# Altium project DSO.PrjPCB
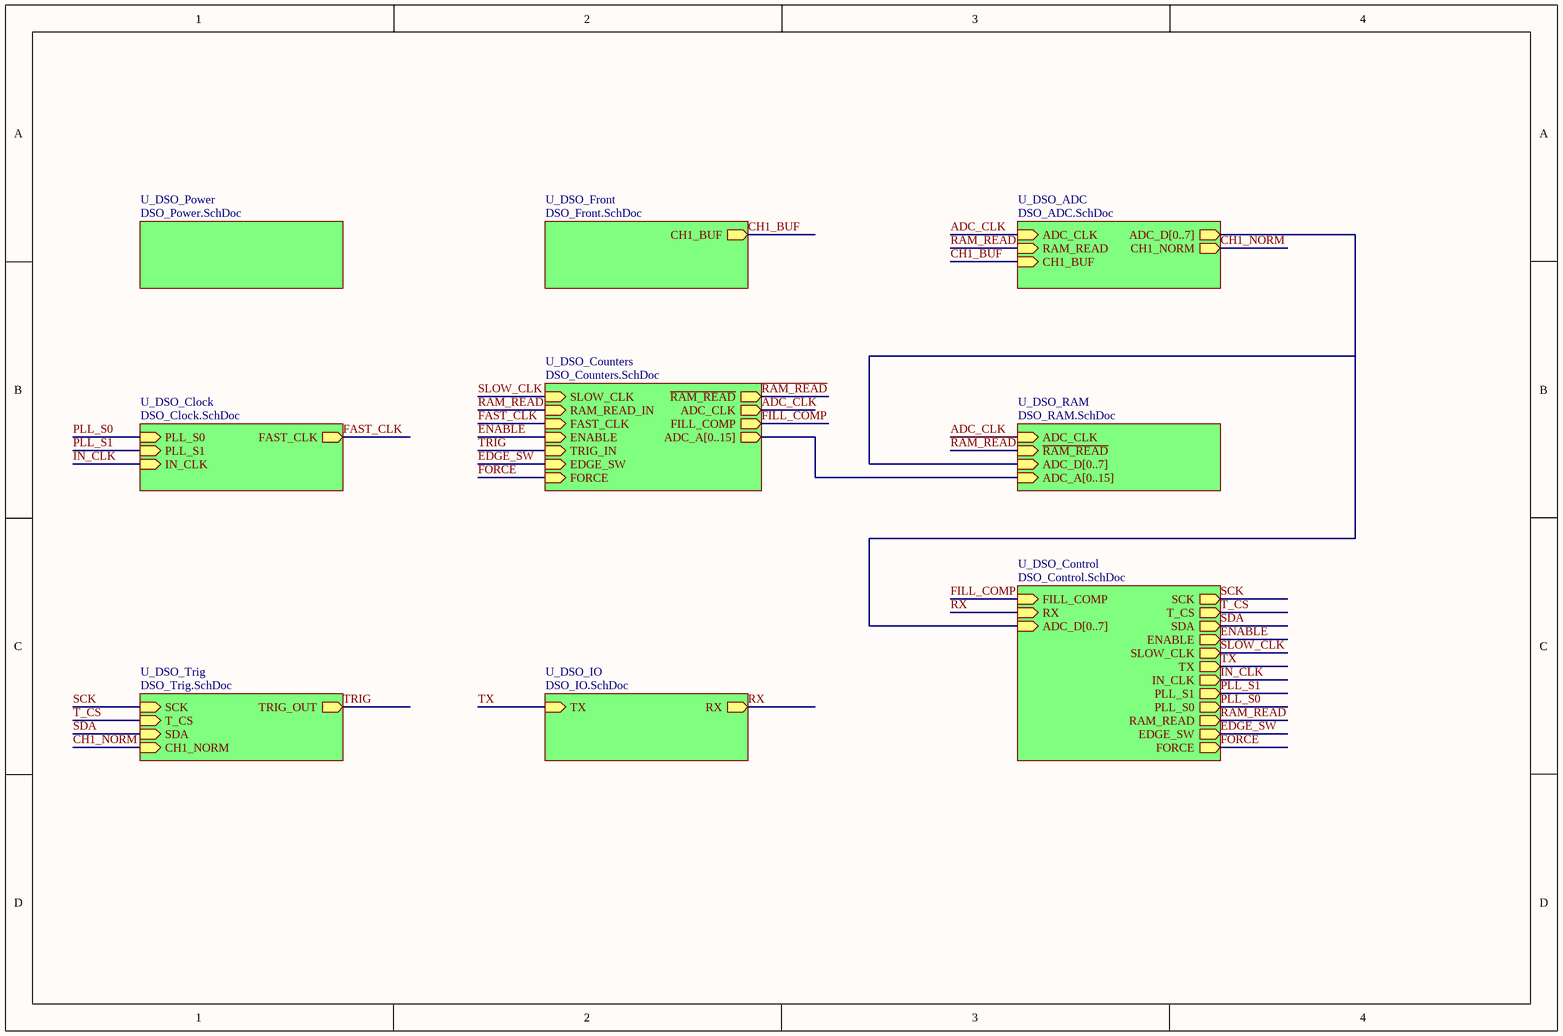
[diagram p0: DSO_Top.SchDoc]
4 sheets, 6 parts. Net scope: hierarchical (ports join the sheet entries above them; power ports are global).
Board file: DSO.PcbDoc
Sheets:
  DSO_Top.SchDoc
    U_DSO_Clock = DSO_Clock.SchDoc
    U_DSO_Power = DSO_Power.SchDoc
    U_DSO_Trig = DSO_Trig.SchDoc

## Sheet DSO_Top.SchDoc: Schematic_Name
size A4; CompanyName: University of Melbourne; Engineer: Your Name Here; DocumentNumber: 1; Revision: 0.1; SheetNumber: 1; SheetTotal: 1; Title_Project: Project_Title; StudentNo: Student No.

### Sub-sheets
U_DSO_ADC = DSO_ADC.SchDoc (file not in this document): ADC_CLK (in), ADC_D[0..7] (out), RAM_READ (in), CH1_BUF (in), CH1_NORM (out)
U_DSO_Clock = DSO_Clock.SchDoc: FAST_CLK (out), PLL_S0 (in), IN_CLK (in), PLL_S1 (in)
U_DSO_Control = DSO_Control.SchDoc (file not in this document): SCK (out), T_CS (out), SDA (out), ENABLE (out), FILL_COMP (in), SLOW_CLK (out), TX (out), RX (in), IN_CLK (out), PLL_S1 (out), PLL_S0 (out), RAM_READ (out), ADC_D[0..7] (in), EDGE_SW (out), FORCE (out)
U_DSO_Counters = DSO_Counters.SchDoc (file not in this document): SLOW_CLK (in), ~{RAM_READ} (out), ADC_CLK (out), RAM_READ_IN (in), FAST_CLK (in), FILL_COMP (out), ENABLE (in), TRIG_IN (in), EDGE_SW (in), FORCE (in), ADC_A[0..15] (out)
U_DSO_Front = DSO_Front.SchDoc (file not in this document): CH1_BUF (out)
U_DSO_IO = DSO_IO.SchDoc (file not in this document): TX (in), RX (out)
U_DSO_Power = DSO_Power.SchDoc: no entries
U_DSO_RAM = DSO_RAM.SchDoc (file not in this document): ADC_CLK (in), ~{RAM_READ} (in), ADC_D[0..7] (in), ADC_A[0..15] (in)
U_DSO_Trig = DSO_Trig.SchDoc: TRIG_OUT (out), SCK (in), T_CS (in), SDA (in), CH1_NORM (in)

### Nets
ADC_CLK: sheet U_DSO_ADC/ADC_CLK, sheet U_DSO_Counters/ADC_CLK, sheet U_DSO_RAM/ADC_CLK
CH1_BUF: sheet U_DSO_ADC/CH1_BUF, sheet U_DSO_Front/CH1_BUF
CH1_NORM: sheet U_DSO_ADC/CH1_NORM, sheet U_DSO_Trig/CH1_NORM
EDGE_SW: sheet U_DSO_Control/EDGE_SW, sheet U_DSO_Counters/EDGE_SW
ENABLE: sheet U_DSO_Control/ENABLE, sheet U_DSO_Counters/ENABLE
FAST_CLK: sheet U_DSO_Clock/FAST_CLK, sheet U_DSO_Counters/FAST_CLK
FILL_COMP: sheet U_DSO_Control/FILL_COMP, sheet U_DSO_Counters/FILL_COMP
FORCE: sheet U_DSO_Control/FORCE, sheet U_DSO_Counters/FORCE
IN_CLK: sheet U_DSO_Clock/IN_CLK, sheet U_DSO_Control/IN_CLK
PLL_S0: sheet U_DSO_Clock/PLL_S0, sheet U_DSO_Control/PLL_S0
PLL_S1: sheet U_DSO_Clock/PLL_S1, sheet U_DSO_Control/PLL_S1
~{RAM_READ}: sheet U_DSO_Counters/~{RAM_READ}, sheet U_DSO_RAM/~{RAM_READ}
RAM_READ: sheet U_DSO_ADC/RAM_READ, sheet U_DSO_Control/RAM_READ, sheet U_DSO_Counters/RAM_READ_IN
RX: sheet U_DSO_Control/RX, sheet U_DSO_IO/RX
SCK: sheet U_DSO_Control/SCK, sheet U_DSO_Trig/SCK
SDA: sheet U_DSO_Control/SDA, sheet U_DSO_Trig/SDA
SLOW_CLK: sheet U_DSO_Control/SLOW_CLK, sheet U_DSO_Counters/SLOW_CLK
T_CS: sheet U_DSO_Control/T_CS, sheet U_DSO_Trig/T_CS
TRIG: sheet U_DSO_Counters/TRIG_IN, sheet U_DSO_Trig/TRIG_OUT
TX: sheet U_DSO_Control/TX, sheet U_DSO_IO/TX

### Buses and harness runs
bus sheet U_DSO_ADC/ADC_D[0..7] = sheet U_DSO_Control/ADC_D[0..7] = sheet U_DSO_RAM/ADC_D[0..7]
bus sheet U_DSO_Counters/ADC_A[0..15] = sheet U_DSO_RAM/ADC_A[0..15]

## Sheet DSO_Clock.SchDoc: Schematic_Name
size A4; CompanyName: University of Melbourne; Engineer: Your Name Here; DocumentNumber: 1; Revision: 0.1; SheetNumber: 1; SheetTotal: 1; Title_Project: Project_Title; StudentNo: Student No.
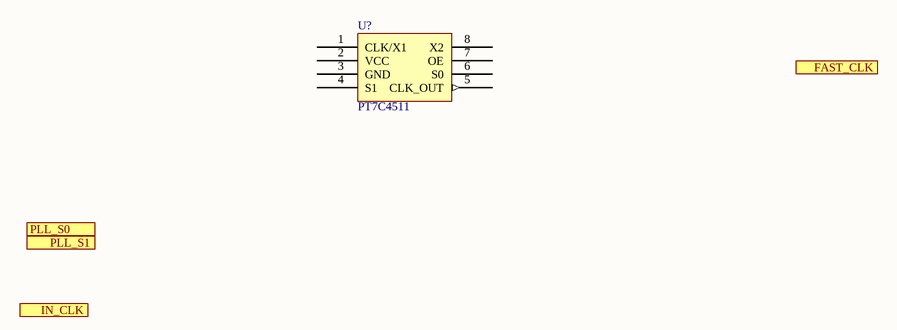
[diagram p1: DSO_Clock.SchDoc]

### Parts
(Parts that share a designator on the sheet are numbered #1, #2 ... from top to bottom, then left to right.)
U?#1  PT7C4511  [SOIC-8]

### Ports
FAST_CLK (out), IN_CLK (in), PLL_S0 (in), PLL_S1 (in)

### Nets

Not connected (* = marked no-connect by the designer): U?#1 1(CLK/X1) 2(VCC) 3(GND) 4(S1) 5(CLK_OUT) 6(S0) 7(OE) 8(X2)

### Library data of the parts
U?#1 = PT7C4511: PLL Clock Multiplier; Reviewed by: RM - 2018/08/05; Supplier 1: Digi-Key; Supplier Part Number 1: PT7C4511WEXDICT-ND

## Sheet DSO_Power.SchDoc: Schematic_Name
size A4; CompanyName: University of Melbourne; Engineer: Your Name Here; DocumentNumber: 1; Revision: 0.1; SheetNumber: 1; SheetTotal: 1; Title_Project: Project_Title; StudentNo: Student No.
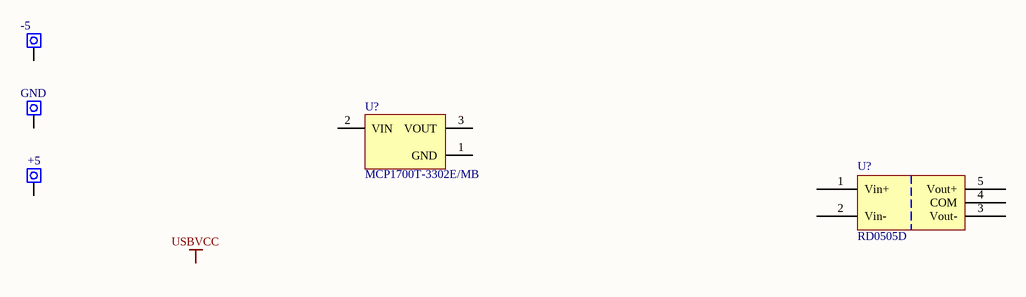
[diagram p2: DSO_Power.SchDoc]

### Parts
(Parts that share a designator on the sheet are numbered #1, #2 ... from top to bottom, then left to right.)
TP?#1  -5  [PIN 1.8mm]
TP?#2  GND  [PIN 1.8mm]
TP?#3  +5  [PIN 1.8mm]
U?#2  MCP1700T-3302E/MB  [SOT89]
U?#3  RD0505D  [SIP_NMG]

### Nets

Not connected (* = marked no-connect by the designer): TP?#1 1; TP?#2 1; TP?#3 1; U?#2 1(GND) 2(VIN) 3(VOUT); U?#3 1(Vin+) 2(Vin-) 3(Vout-) 4(COM) 5(Vout+)

### Notes on the sheet
- Labels drawn without touching a wire or pin: USBVCC

### Library data of the parts
TP?#1-TP?#3 = WIRE: Pad
U?#2 = MCP1700T: Low Quiescent Current LDO, 3-Pin SOT-89, Extended Temperature, Tape and Reel; Reviewed by: RM - 2018/08/05; Supplier 1: Digi-Key; Supplier Part Number 1: MCP1700T3302EMBCT-ND
U?#3 = RD0505D: (ADV) DC to DC converter 5V in +-5V out; Reviewed by: RM - 2018/08/05; Supplier Part Number 1: 945-1136-ND; Supplier 1: Digi-Key

## Sheet DSO_Trig.SchDoc: Schematic_Name
size A4; CompanyName: University of Melbourne; Engineer: Your Name Here; DocumentNumber: 1; Revision: 0.1; SheetNumber: 1; SheetTotal: 1; Title_Project: Project_Title; StudentNo: Student No.
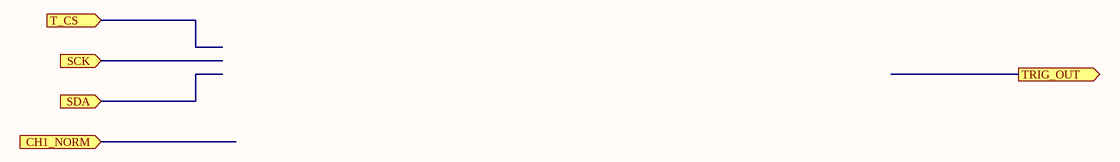
[diagram p3: DSO_Trig.SchDoc]

### Ports
CH1_NORM (in), SCK (in), SDA (in), T_CS (in), TRIG_OUT (out)